# Altium project PCB_Project1.PrjPCB
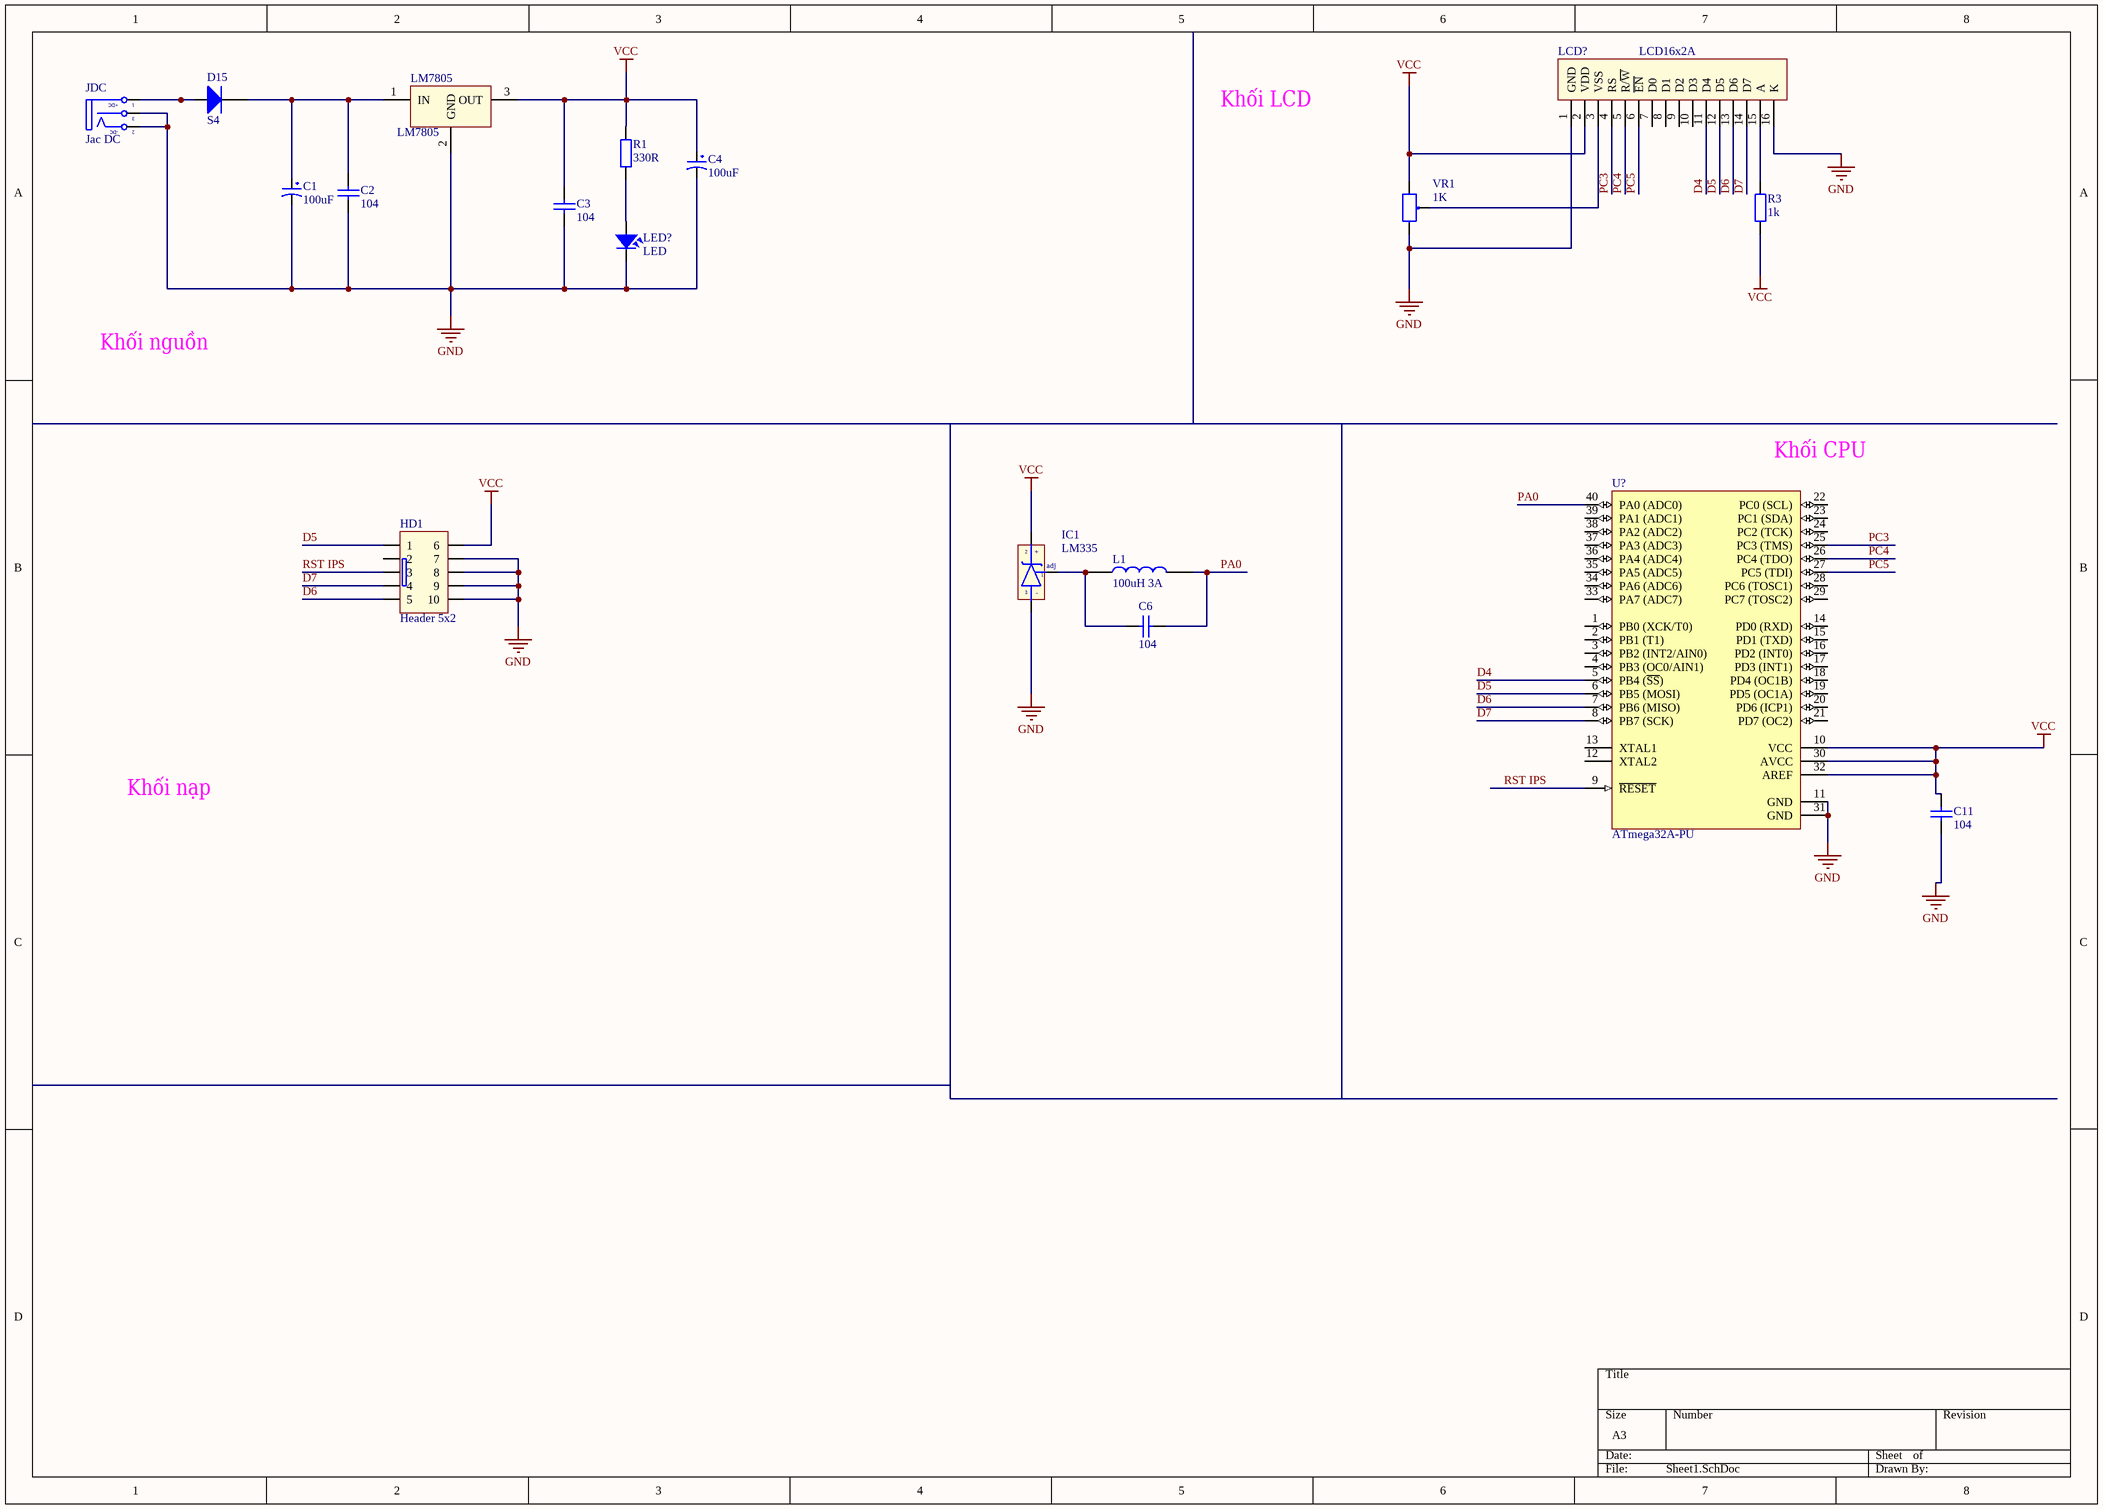
[diagram p0: Sheet1.SchDoc]
1 sheet, 18 parts. Net scope: global (net labels, ports and power ports of the same name join across sheets).
Board file: PCB1.PcbDoc

## Sheet Sheet1.SchDoc
size A3

### Parts
C1  100uF  [tu hoa 8mm]
C2  104  [Tu 0805]
C3  104  [Tu 0805]
C4  100uF  [tu hoa 8mm]
C6  104  [Tu 0805]
C11  104  [Tu 0805]
D15  S4  [DIODE S4]
HD1  Header 5x2  [HED2X5_cen]
IC1  LM335  [QTO-92]
JDC  Jac DC  [DC-IN]
L1  100uH 3A  [CUON_CAM 100UH]
LCD?  LCD16x2A  [LCD16X2]
LED?  LED  [LED-3]
LM7805  LM7805  [QTO-220]
R1  330R  [Tro SMD 0805]
R3  1k  [tro smd 0603]
U?  ATmega32A-PU  [DIP40/W0.6]
VR1  1K  [VR]

### Nets
GND: C1.2 C2.1 C3.1 C4.2 C11.1 HD1.7 HD1.8 HD1.9 HD1.10 IC1.3(-) JDC.2(TN) JDC.3(S) LCD?.1(GND) LCD?.16(K) LED?.2 LM7805.2(GND) U?.11(GND) U?.31(GND) VR1.3
VCC: C3.2 C4.1 C11.2 HD1.6 IC1.2(+) LCD?.2(VDD) LM7805.3(OUT) R1.2 R3.1 U?.10(VCC) U?.30(AVCC) U?.32(AREF) VR1.1
D4: LCD?.11(D4) U?.5(PB4_(~{SS}))
D5: HD1.1 LCD?.12(D5) U?.6(PB5_(MOSI))
D6: HD1.5 LCD?.13(D6) U?.7(PB6_(MISO))
D7: HD1.4 LCD?.14(D7) U?.8(PB7_(SCK))
PA0: C6.2 L1.2 U?.40(PA0_(ADC0))
PC3: LCD?.4(RS) U?.25(PC3_(TMS))
PC4: LCD?.5(R/~{W}) U?.26(PC4_(TDO))
PC5: LCD?.6(~{EN}) U?.27(PC5_(TDI))
RST IPS: HD1.3 U?.9(~{RESET})
NetC1_1: C1.1 C2.2 D15.2(K) LM7805.1(IN)
NetC6_1: C6.1 IC1.1(adj) L1.1
NetD15_1: D15.1(A) JDC.1(T)
NetLCD?_3: LCD?.3(VSS) VR1.2
NetLCD?_15: LCD?.15(A) R3.2
NetLED?_1: LED?.1 R1.1

Not connected (* = marked no-connect by the designer): HD1 2; LCD? 7(D0) 8(D1) 9(D2) 10(D3); U? 1(PB0_(XCK/T0)) 2(PB1_(T1)) 3(PB2_(INT2/AIN0)) 4(PB3_(OC0/AIN1)) 12(XTAL2) 13(XTAL1) 14(PD0_(RXD)) 15(PD1_(TXD)) 16(PD2_(INT0)) 17(PD3_(INT1)) 18(PD4_(OC1B)) 19(PD5_(OC1A)) 20(PD6_(ICP1)) 21(PD7_(OC2)) 22(PC0_(SCL)) 23(PC1_(SDA)) 24(PC2_(TCK)) 28(PC6_(TOSC1)) 29(PC7_(TOSC2)) 33(PA7_(ADC7)) 34(PA6_(ADC6)) 35(PA5_(ADC5)) 36(PA4_(ADC4)) 37(PA3_(ADC3)) 38(PA2_(ADC2)) 39(PA1_(ADC1))

### Notes on the sheet
- Khối LCD
- Khối nguồn
- (near U?) Khối CPU
- Khối nạp
- (in symbol DCIN) +DC; -DC

### Library data of the parts
C1 C4 = Tu Hoa 100uF 35V 8x11: Cắm; Don_Vi: Con; So_Chan: 2; Ten_Linh_Kien: Tụ Hóa 100uF 35V 8x11MM; Ma_Hang: MH002807; Chung_Loai: Cắm; Kieu_Chan: *
C2 C3 C6 C11 = Tu 104: Dán; Ten_Linh_Kien: Tụ 0805 104-100nF 10% 50V; Don_Vi: Con; Ma_Hang: MH004551; Kieu_Chan: *; Chung_Loai: Dán; Ghi_Chu: *
D15 = Diode S4: Dán; Ten_Linh_Kien: Diode S4 SOD123 ( 1N5819 SOD123); Ma_Hang: MH005519; Don_Vi: Con; Ghi_Chu: *; Chung_Loai: Dán; Kieu_Chan: *
HD1 = HED5x2: Value: Header 5x2
IC1 = LM335: Teminal; Value: LM335
JDC = DCIN: Jac DC input; Value: Jac DC
L1 = CUON CAM 100uH DIP: Dán; Don_Vi: Con; Ma_Hang: MH002209; Ten_Linh_Kien: Cuộn Cảm 100uH 3A 8x10MM; Chung_Loai: Dán; Ghi Chu: *; Kieu Chan: *
LCD? = LCD16x2: LCD dipslay 16 char, 2 line; Value: LCD16x2A
LED? = LED: LED Single colour Green and Red; Value: LED 3 ly Single Colour
LM7805 = LM78xx: On ap +, from + 5 to + 24VDC; Value: LM7805
R1 = Tro 0805 5% 330R: Dán; Don_Vi: Con; So_Chan: 2; Ten_Linh_Kien: Trở 0805 5% 330R; Ma_Hang: MH005337; Chung_Loai: Dán; Kieu_Chan: *
R3 = Tro 0603 5% 1k: Dán; Don_Vi: Con; So_Chan: 2; Ten_Linh_Kien: Trở 0603 5% 1k; Ma_Hang: MH006319; Chung_Loai: Dán; Kieu_Chan: *
U? = ATmega32A-PU: 8-Bit AVR Microcontroller with 32K Bytes of In-System Programmable Flash Memory; Published: 17-Sep-2003; DatasheetVersion: 2503C-AVR-10/02; PackageVersion: revB, Sep-2001; PackageReference: 40P6; Publisher: Altium Limited; PackageDescription: 40-lead (0.600"/15.24mm Wide) Plastic Dual Inline Package (PDIP); Supplier 1: Digi-Key; Supplier Part Number 1: ATMEGA32-16PC-ND; Supplier 2: Mouser; Supplier Part Number 2: 556-ATMEGA32-16PC; Code_JEDEC: MS-011-AC; ComponentLink1Description: Datasheet; ComponentLink1URL: http://www.atmel.com/dyn/resources/prod_documents/doc2503.pdf; ComponentLink2Description: Atmel.com Home; ComponentLink2URL: http://www.atmel.com
VR1 = Bien Tro Tinh Chinh 1K: Cắm; Don_Vi: Con; Ten_Linh_Kien: Biến Trở VR 102-1K 3296W; Ma_Hang: MH003234; Kieu_Chan: *; Chung_Loai: Cắm